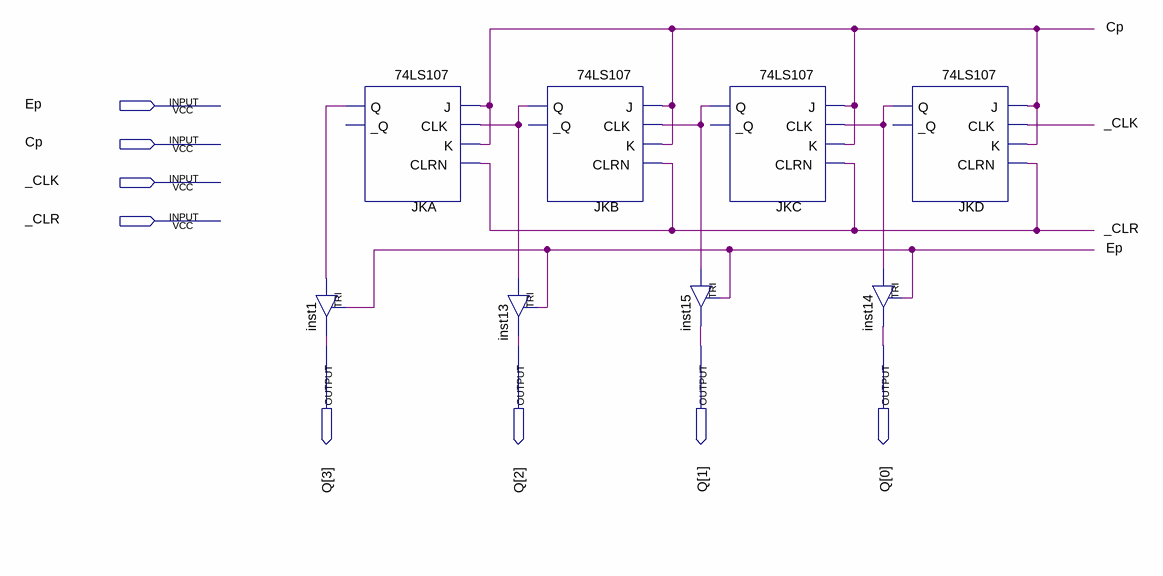
[diagram p0: schematic sheet]
// Quartus schematic Contador_de_Programas.bdf as structural Verilog: 8 symbols, 8 pins
module Contador_de_Programas (
  input  Ep,
  input  Cp,
  input  _CLK,
  input  _CLR,
  output [3:0] Q
);

  wire JKA_q, JKB_q, JKC_q, JKD_q;

  \74LS107  JKA (.J(Cp), .CLK(JKB_q), .K(Cp), .CLRN(_CLR), .Q(JKA_q));  // open: _Q
  TRI inst1 (.IN(JKA_q), .OE(Ep), .OUT(Q[3]));
  TRI inst13 (.IN(JKB_q), .OE(Ep), .OUT(Q[2]));
  \74LS107  JKB (.J(Cp), .CLK(JKC_q), .K(Cp), .CLRN(_CLR), .Q(JKB_q));  // open: _Q
  \74LS107  JKC (.J(Cp), .CLK(JKD_q), .K(Cp), .CLRN(_CLR), .Q(JKC_q));  // open: _Q
  TRI inst15 (.IN(JKC_q), .OE(Ep), .OUT(Q[1]));
  \74LS107  JKD (.J(Cp), .CLK(_CLK), .K(Cp), .CLRN(_CLR), .Q(JKD_q));  // open: _Q
  TRI inst14 (.IN(JKD_q), .OE(Ep), .OUT(Q[0]));
endmodule
